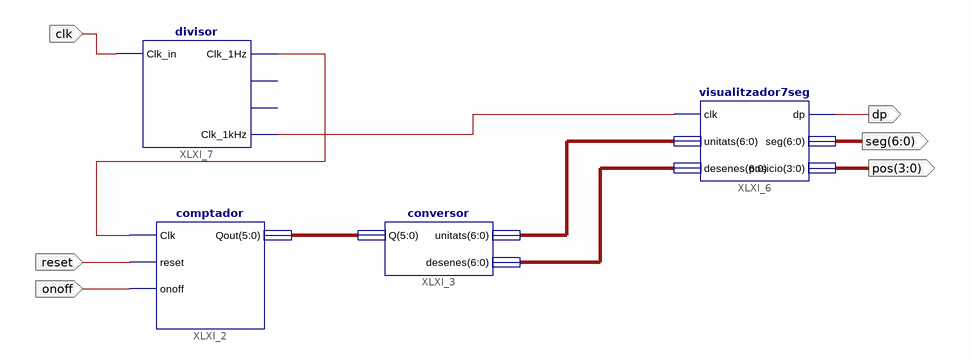
[diagram p0: schematic sheet 1]
// Xilinx ISE schematic Crono.sch (spartan3e) as structural Verilog: 4 symbols, 6 ports
module Crono (
  input  reset,
  input  onoff,
  input  clk,
  output dp,
  output [6:0] seg,
  output [3:0] pos
);

  wire XLXN_2, XLXN_15;
  wire [5:0] XLXN_4;
  wire [6:0] XLXN_5, XLXN_6;

  comptador XLXI_2 (.Clk(XLXN_2), .reset(reset), .onoff(onoff), .Qout(XLXN_4));
  conversor XLXI_3 (.Q(XLXN_4), .unitats(XLXN_5), .desenes(XLXN_6));
  visualitzador7seg XLXI_6 (.clk(XLXN_15), .unitats(XLXN_5), .desenes(XLXN_6), .dp(dp), .seg(seg), .posicio(pos));
  divisor XLXI_7 (.Clk_in(clk), .Clk_1Hz(XLXN_2), .Clk_1kHz(XLXN_15));  // open: Clk_10Hz, Clk_100Hz
endmodule
